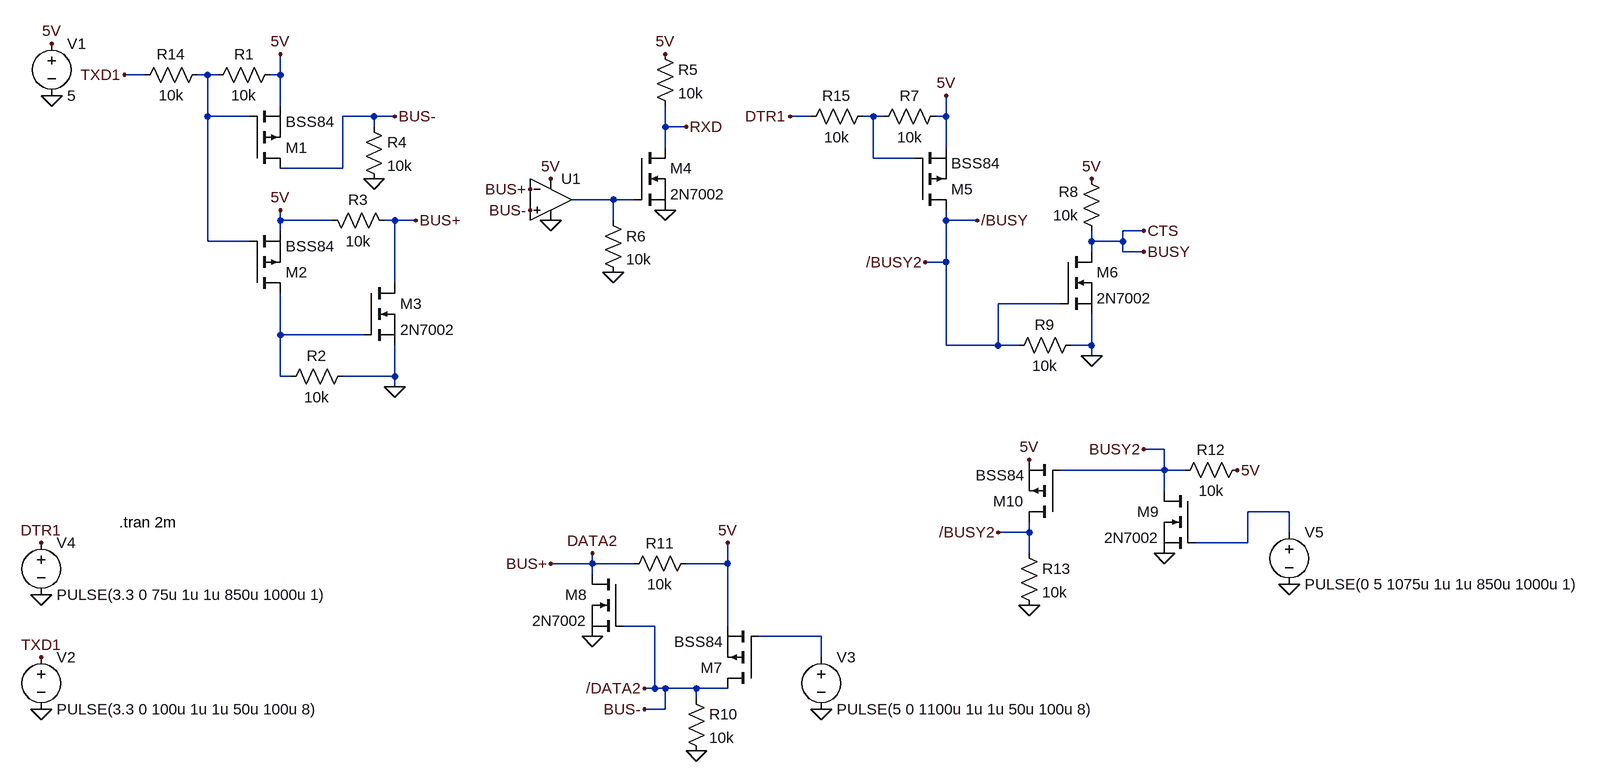
[diagram p0: schematic mosfet-datalines.asc]
mosfet-datalines.asc, the LTspice schematic file:
Version 4
SHEET 1 1328 772
WIRE -912 -336 -944 -336
WIRE -816 -336 -832 -336
WIRE -800 -336 -816 -336
WIRE -704 -336 -704 -368
WIRE -704 -336 -720 -336
WIRE -704 -288 -704 -336
WIRE -816 -272 -816 -336
WIRE -752 -272 -816 -272
WIRE -560 -272 -608 -272
WIRE -528 -272 -560 -272
WIRE 112 -272 80 -272
WIRE 208 -272 192 -272
WIRE 224 -272 208 -272
WIRE 320 -272 320 -304
WIRE 320 -272 304 -272
WIRE -560 -256 -560 -272
WIRE -112 -256 -112 -288
WIRE -80 -256 -112 -256
WIRE -112 -224 -112 -256
WIRE 320 -224 320 -272
WIRE 208 -208 208 -272
WIRE 272 -208 208 -208
WIRE -608 -192 -608 -272
WIRE -608 -192 -704 -192
WIRE -192 -144 -256 -144
WIRE -160 -144 -192 -144
WIRE -704 -112 -704 -128
WIRE -624 -112 -704 -112
WIRE -528 -112 -544 -112
WIRE -496 -112 -528 -112
WIRE -192 -112 -192 -144
WIRE 320 -112 320 -128
WIRE 368 -112 320 -112
WIRE -704 -96 -704 -112
WIRE 624 -96 592 -96
WIRE -816 -80 -816 -272
WIRE -752 -80 -816 -80
WIRE 544 -80 544 -96
WIRE 592 -80 592 -96
WIRE 592 -80 544 -80
WIRE 544 -64 544 -80
WIRE 592 -64 592 -80
WIRE 624 -64 592 -64
WIRE 320 -48 320 -112
WIRE 320 -48 288 -48
WIRE -528 -16 -528 -112
WIRE 496 16 400 16
WIRE -704 64 -704 0
WIRE -576 64 -704 64
WIRE 320 80 320 -48
WIRE 400 80 400 16
WIRE 400 80 320 80
WIRE 432 80 400 80
WIRE 544 80 544 32
WIRE 544 80 512 80
WIRE 544 96 544 80
WIRE -704 128 -704 64
WIRE -688 128 -704 128
WIRE -528 128 -528 80
WIRE -528 128 -608 128
WIRE -528 144 -528 128
WIRE 656 240 624 240
WIRE 656 272 656 240
WIRE 656 272 496 272
WIRE 688 272 656 272
WIRE 656 304 656 272
WIRE 848 336 784 336
WIRE 448 368 448 352
WIRE 448 368 400 368
WIRE 848 368 848 336
WIRE 784 384 784 336
WIRE 784 384 704 384
WIRE 448 400 448 368
WIRE -224 416 -224 400
WIRE -224 416 -288 416
WIRE -160 416 -224 416
WIRE -16 416 -16 384
WIRE -16 416 -80 416
WIRE -224 432 -224 416
WIRE -128 512 -176 512
WIRE -16 512 -16 416
WIRE 128 528 32 528
WIRE 128 560 128 528
WIRE -128 608 -128 512
WIRE -128 608 -144 608
WIRE -112 608 -128 608
WIRE -64 608 -112 608
WIRE -16 608 -64 608
WIRE -64 624 -64 608
WIRE -112 640 -112 608
WIRE -112 640 -144 640
FLAG -1056 -304 0
FLAG -1056 -384 5V
FLAG -1072 640 0
FLAG -1072 560 TXD1
FLAG -944 -336 TXD1
FLAG -704 -368 5V
FLAG -528 -272 BUS-
FLAG -528 144 0
FLAG -704 -128 5V
FLAG -496 -112 BUS+
FLAG -560 -176 0
FLAG -288 -112 0
FLAG -288 -176 5V
FLAG -320 -160 BUS+
FLAG -320 -128 BUS-
FLAG -80 -256 RXD
FLAG -112 -368 5V
FLAG -112 -128 0
FLAG -192 -32 0
FLAG 128 640 0
FLAG -224 400 DATA2
FLAG -1072 464 0
FLAG -1072 384 DTR1
FLAG 848 448 0
FLAG 400 368 /BUSY2
FLAG 320 -304 5V
FLAG 80 -272 DTR1
FLAG 368 -112 /BUSY
FLAG 544 -176 5V
FLAG 624 -96 CTS
FLAG 624 -64 BUSY
FLAG 544 96 0
FLAG -144 608 /DATA2
FLAG -16 384 5V
FLAG -224 528 0
FLAG -64 704 0
FLAG -288 416 BUS+
FLAG -144 640 BUS-
FLAG 656 400 0
FLAG 624 240 BUSY2
FLAG 768 272 5V
FLAG 448 480 0
FLAG 448 256 5V
FLAG 288 -48 /BUSY2
SYMBOL voltage -1056 -400 R0
WINDOW 123 0 0 Left 0
WINDOW 39 0 0 Left 0
SYMATTR InstName V1
SYMATTR Value 5
SYMBOL voltage -1072 544 R0
WINDOW 123 0 0 Left 0
WINDOW 39 0 0 Left 0
SYMATTR InstName V2
SYMATTR Value PULSE(3.3 0 100u 1u 1u 50u 100u 8)
SYMBOL pmos -752 -192 M180
SYMATTR InstName M1
SYMATTR Value BSS84
SYMBOL pmos -752 0 M180
SYMATTR InstName M2
SYMATTR Value BSS84
SYMBOL nmos -576 -16 R0
SYMATTR InstName M3
SYMATTR Value 2N7002
SYMBOL res -704 -352 R90
WINDOW 0 0 56 VBottom 2
WINDOW 3 32 56 VTop 2
SYMATTR InstName R1
SYMATTR Value 10k
SYMBOL res -592 112 R90
WINDOW 0 0 56 VBottom 2
WINDOW 3 32 56 VTop 2
SYMATTR InstName R2
SYMATTR Value 10k
SYMBOL res -640 -128 M90
WINDOW 0 0 56 VBottom 2
WINDOW 3 32 56 VTop 2
SYMATTR InstName R3
SYMATTR Value 10k
SYMBOL res -576 -272 R0
SYMATTR InstName R4
SYMATTR Value 10k
SYMBOL nmos -160 -224 R0
SYMATTR InstName M4
SYMATTR Value 2N7002
SYMBOL res -128 -384 R0
SYMATTR InstName R5
SYMATTR Value 10k
SYMBOL res -208 -128 R0
SYMATTR InstName R6
SYMATTR Value 10k
SYMBOL voltage 128 544 R0
WINDOW 123 0 0 Left 0
WINDOW 39 0 0 Left 0
SYMATTR InstName V3
SYMATTR Value PULSE(5 0 1100u 1u 1u 50u 100u 8)
SYMBOL voltage -1072 368 R0
WINDOW 123 0 0 Left 0
WINDOW 39 0 0 Left 0
SYMATTR InstName V4
SYMATTR Value PULSE(3.3 0 75u 1u 1u 850u 1000u 1)
SYMBOL voltage 848 352 R0
WINDOW 123 0 0 Left 0
WINDOW 39 0 0 Left 0
SYMATTR InstName V5
SYMATTR Value PULSE(0 5 1075u 1u 1u 850u 1000u 1)
SYMBOL pmos 272 -128 M180
SYMATTR InstName M5
SYMATTR Value BSS84
SYMBOL nmos 496 -64 R0
SYMATTR InstName M6
SYMATTR Value 2N7002
SYMBOL res 320 -288 R90
WINDOW 0 0 56 VBottom 2
WINDOW 3 32 56 VTop 2
SYMATTR InstName R7
SYMATTR Value 10k
SYMBOL res 560 -80 R180
WINDOW 0 36 76 Left 2
WINDOW 3 36 40 Left 2
SYMATTR InstName R8
SYMATTR Value 10k
SYMBOL res 416 96 R270
WINDOW 0 32 56 VTop 2
WINDOW 3 0 56 VBottom 2
SYMATTR InstName R9
SYMATTR Value 10k
SYMBOL Opamps\\UniversalOpamp2 -288 -144 R0
SYMATTR InstName U1
SYMATTR Value2 Avol=100k GBW=1Meg Slew=1Meg
SYMATTR SpiceLine Ilimit=25m Rail=0 Vos=1m
SYMBOL pmos 32 608 R180
SYMATTR InstName M7
SYMATTR Value BSS84
SYMBOL nmos -176 432 M0
SYMATTR InstName M8
SYMATTR Value 2N7002
SYMBOL res -80 608 R0
SYMATTR InstName R10
SYMATTR Value 10k
SYMBOL res -64 400 R90
WINDOW 0 0 56 VBottom 2
WINDOW 3 32 56 VTop 2
SYMATTR InstName R11
SYMATTR Value 10k
SYMBOL nmos 704 304 M0
SYMATTR InstName M9
SYMATTR Value 2N7002
SYMBOL res 672 288 R270
WINDOW 0 32 56 VTop 2
WINDOW 3 0 56 VBottom 2
SYMATTR InstName R12
SYMATTR Value 10k
SYMBOL pmos 496 352 R180
SYMATTR InstName M10
SYMATTR Value BSS84
SYMBOL res 432 384 R0
SYMATTR InstName R13
SYMATTR Value 10k
SYMBOL res -816 -352 R90
WINDOW 0 0 56 VBottom 2
WINDOW 3 32 56 VTop 2
SYMATTR InstName R14
SYMATTR Value 10k
SYMBOL res 208 -288 R90
WINDOW 0 0 56 VBottom 2
WINDOW 3 32 56 VTop 2
SYMATTR InstName R15
SYMATTR Value 10k
TEXT -952 352 Left 2 !.tran 2m

The netlist it stands for:
* mosfet-datalines.asc
V1 5V 0 5
V2 TXD1 0 PULSE(3.3 0 100u 1u 1u 50u 100u 8)
M1 /DATA2 N001 5V 5V BSS84
M2 N004 N001 5V 5V BSS84
M3 DATA2 N004 0 0 2N7002
R1 5V N001 10k
R2 0 N004 10k
R3 5V DATA2 10k
R4 /DATA2 0 10k
M4 RXD N003 0 0 2N7002
R5 5V RXD 10k
R6 N003 0 10k
V3 N006 0 PULSE(5 0 1100u 1u 1u 50u 100u 8)
V4 DTR1 0 PULSE(3.3 0 75u 1u 1u 850u 1000u 1)
V5 N005 0 PULSE(0 5 1075u 1u 1u 850u 1000u 1)
M5 /BUSY N002 5V 5V BSS84
M6 BUSY /BUSY 0 0 2N7002
R7 5V N002 10k
R8 BUSY 5V 10k
R9 /BUSY 0 10k
XU1 /DATA2 DATA2 5V 0 N003 level.2 Avol=100k GBW=1Meg Slew=1Meg Ilimit=25m Rail=0 Vos=1m en=0 enk=0 in=0 ink=0 Rin=500Meg  ; pins IN+ IN- V+ V- OUT
M7 /DATA2 N006 5V 5V BSS84
M8 DATA2 /DATA2 0 0 2N7002
R10 /DATA2 0 10k
R11 5V DATA2 10k
M9 BUSY2 N005 0 0 2N7002
R12 BUSY2 5V 10k
M10 /BUSY BUSY2 5V 5V BSS84
R13 /BUSY 0 10k
R14 N001 TXD1 10k
R15 N002 DTR1 10k
.model NMOS NMOS
.model PMOS PMOS
.lib standard.mos
.tran 2m
.lib UniversalOpamps2.sub
.backanno
.end